# Altium schematic sheet sincronico.SchDoc
size A
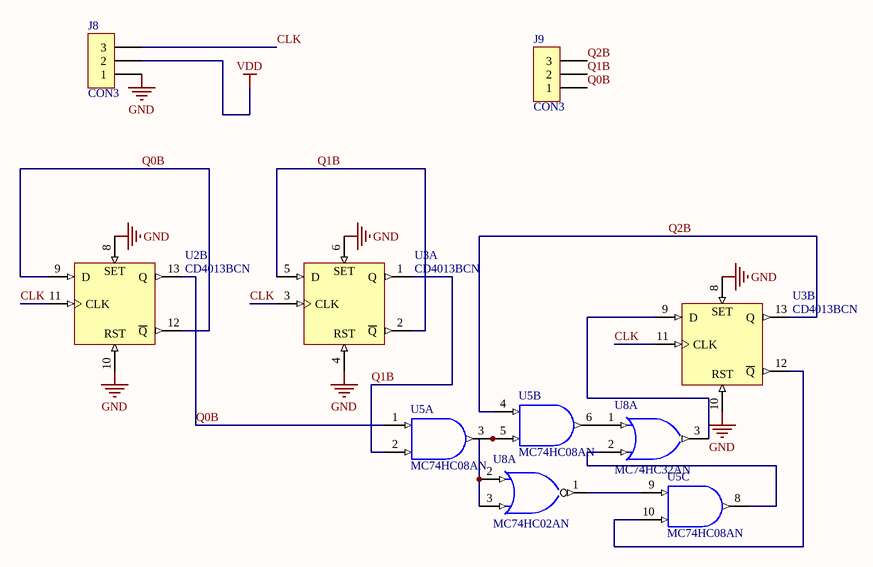
[diagram p0: sincronico.SchDoc]

## Parts
(Parts that share a designator on the sheet are numbered #1, #2 ... from top to bottom, then left to right.)
J8  CON3  [SIP3]
J9  CON3  [SIP3]
U2  CD4013BCN  [N14A]  (part B of 2)
U3  CD4013BCN  [N14A]  (parts A,B of 2)
U5  MC74HC08AN  [646-06]  (parts A,B,C of 4)
U8#1  MC74HC32AN  [646-06]  (part A of 4)
U8#2  MC74HC02AN  [646-06]  (part A of 4)

## Nets
GND: J8.1 U2.7(GND) U2.8(S) U2.10(RST) U3.4(RST) U3.6(S) U3.7(GND) U3.8(S) U3.10(RST) U5.7(GND) U8#1.7(GND) U8#2.7(GND)
VDD: J8.2 U2.14(VDD) U3.14(VDD) U5.14(VDD) U8#1.14(VDD) U8#2.14(VDD)
CLK: J8.3 U2.11(CLK) U3.3(CLK) U3.11(CLK)
Q0B: J9.1 U2.9(D) U2.12(~{Q}) U2.13(Q) U5.1(A)
Q1B: J9.2 U3.1(Q) U3.2(~{Q}) U3.5(D) U5.2(B)
Q2B: J9.3 U3.13(Q) U5.4(A)
NetU3_9: U3.9(D) U8#1.3(Y)
NetU3_12: U3.12(~{Q}) U5.10(B)
NetU5_3: U5.3(Y) U5.5(B) U8#2.2(A) U8#2.3(B)
NetU5_6: U5.6(Y) U8#1.1(A)
NetU5_8: U5.8(Y) U8#1.2(B)
NetU5_9: U5.9(A) U8#2.1(Y)

## Notes on the sheet
- (in symbol CD4013BCN, part A) SET
- (in symbol CD4013BCN, part B) SET

## Library data of the parts
U2 U3 = CD4013BCN: Dual D-Type Flip-Flop; Published: 17-Jul-2002; LatestRevisionDate: 29-May-2009; LatestRevisionNote: Component Body Added.; DatasheetVersion: Jan-1999; PackageVersion: 2000; PackageReference: N14A; Publisher: Altium Limited; PackageDescription: DIP, 14-Pin, Row Spacing 7.62 mm, Pitch 2.54 mm; ComponentLink1Description: Manufacturer Link; ComponentLink1URL: http://www.fairchildsemi.com/
U5 = MC74HC08AN: Quad 2-Input AND Gate; Published: 17-Jul-2002; LatestRevisionDate: 06-Jun-2005; LatestRevisionNote: Stylized 3D Model Added; DatasheetVersion: 1989; PackageVersion: 1997; PackageReference: 646-06; Publisher: Altium Limited; PackageDescription: DIP; 14 Leads; Row Spacing 7.62 mm; Pitch 2.54 mm; ComponentLink1Description: Manufacturer Link; ComponentLink1URL: http://www.onsemi.com/site/products/parametrics/0,4446,247,00.html; ComponentLink2Description: Ibis Model; ComponentLink2URL: http://www.onsemi.com/pub/Collateral/MC54HC08AJ.IBS
U8#1 = MC74HC32AN: Quad 2-Input OR Gate; Published: 15-Apr-2002; DatasheetVersion: Mar-2000; PackageVersion: 1995; PackageReference: 646-06; Publisher: Altium Limited; PackageDescription: DIP; 14 Leads; Row Spacing 7.62 mm; Pitch 2.54 mm; ComponentLink1Description: Manufacturer Link; ComponentLink1URL: http://www.onsemi.com/; ComponentLink2Description: Datasheet; ComponentLink2URL: http://www.onsemi.com/pub/Collateral/MC74HC32A-D.PDF
U8#2 = MC74HC02AN: Quad 2-Input NOR Gate; Published: 17-Jul-2002; LatestRevisionDate: 06-Jun-2005; LatestRevisionNote: Stylized 3D Model Added; DatasheetVersion: 1989; PackageVersion: 1997; PackageReference: 646-06; Publisher: Altium Limited; PackageDescription: DIP; 14 Leads; Row Spacing 7.62 mm; Pitch 2.54 mm; ComponentLink1Description: Manufacturer Link; ComponentLink1URL: http://www.onsemi.com/site/products/parametrics/0,4446,247,00.html; ComponentLink2Description: Ibis Model; ComponentLink2URL: http://www.onsemi.com/pub/Collateral/MC54HC02AJ.IBS